# EAGLE design AstableMultivibrator-NPN-alt (EAGLE 7.2.0)
Forced quenching improves three-transistor FM tuner Lyle Williams -February 29, 2016 http://edn.com/design/diy/4441531/Forced-quenching-improves-three-transistor-FM-tuner
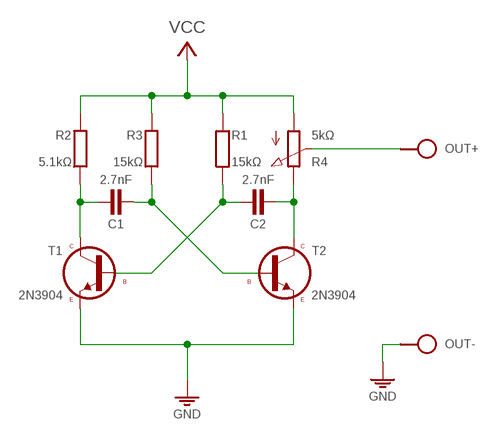
[diagram p0: schematic, sheet 1]

## Parts
C1  2.7nF  C-H075-020X044  [C0750-020X044]
C2  2.7nF  C-H075-020X044  [C0750-020X044]
J1  VCC_GNDPWR-L  [PWR-L]
OUT  SPAD+-+-  [SPAD+-]
R1  15kΩ  R0204/10-V  [0204/10-V]
R2  5.1kΩ  R0204/10-V  [0204/10-V]
R3  15kΩ  R0204/10-V  [0204/10-V]
R4  5kΩ  POT-V  [POT-V]
T1  2N3904  [TO92]
T2  2N3904  [TO92]

## Nets
GND: J1.1 OUT.1 T1.1(E) T2.1(E)
N$1: C2.2 R4.E T2.3(C)
N$2: C1.1 R2.2 T1.3(C)
N$3: C2.1 R1.2 T1.2(B)
N$4: C1.2 R3.2 T2.2(B)
N$6: OUT.2 R4.S
VCC: J1.2 R1.1 R2.1 R3.1 R4.A

## Library data of the parts
C1 C2 = c:C-H
J1 = pad:VCC_GND
OUT = pad:SPAD+-
R1-R3 = r:R: RESISTOR, European symbol
R4 = r:POT
T1 T2 = t:2N3904

## Net classes
0 default: width 0.61 mm

## Board
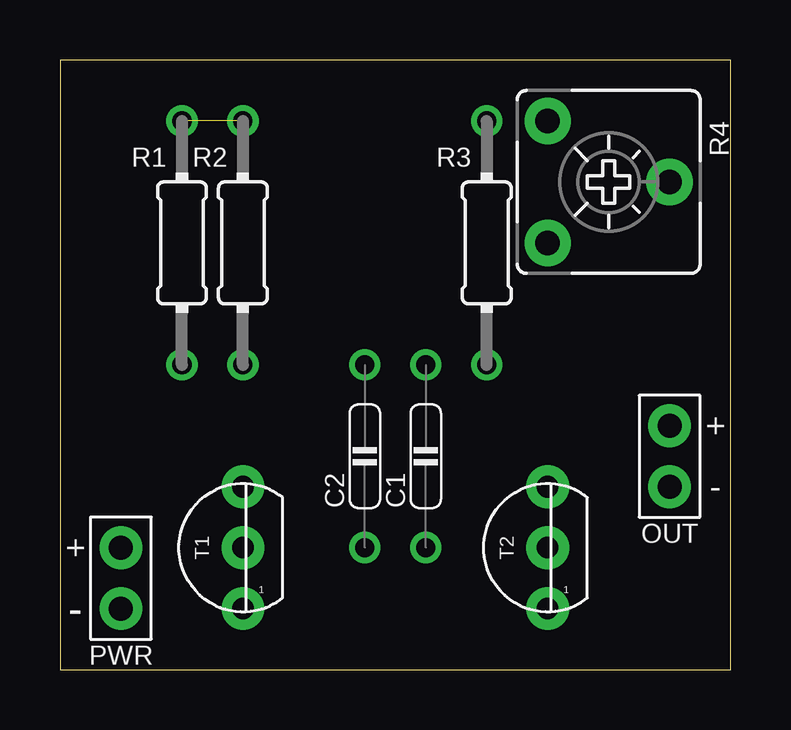
[diagram p1: board, top side]
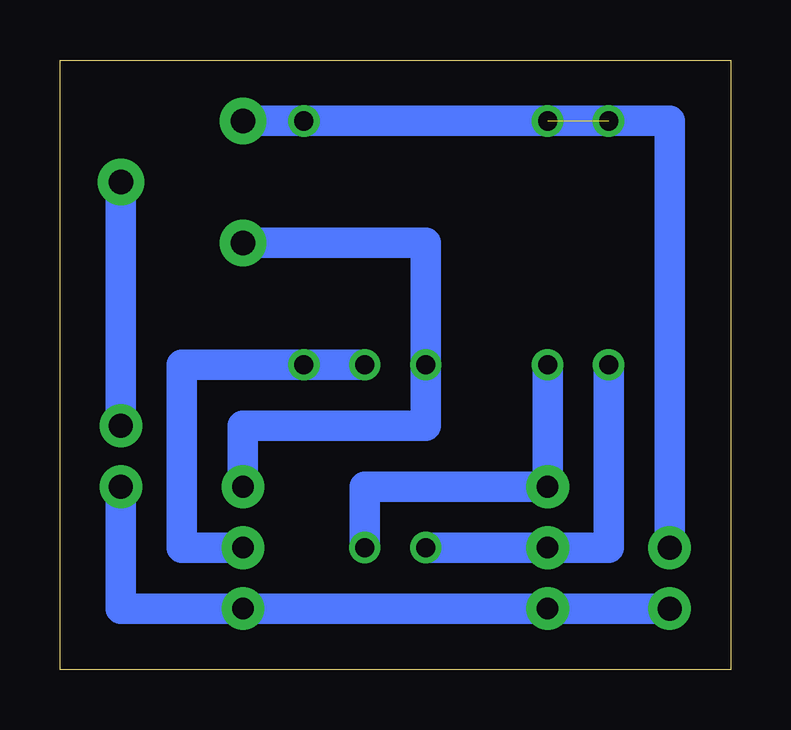
[diagram p2: board, bottom side, seen from below]

Size 27.94 x 25.4 mm. Coordinates in mm from the lower left corner, seen from the top.
Outline: 0,0 27.94,0 27.94,25.4 0,25.4 0,0
Copper layers (1*16): Top 0.035mm / dielectric 1.5mm / Bottom 0.035mm
Design rules "default": minimum track width 10mil, minimum drill 24mil, track to track 8mil, track to pad 8mil, pad to pad 8mil, via to via 8mil, smd to smd 8mil, copper to edge 40mil, drill to drill 8mil, minimum pad ring 10mil, minimum via ring 8mil, stop-mask expansion 4mil, vias tented up to drill 0mil, thermal gap 10mil

### Footprints (pad centres in the part's own frame; a part is rotated, then mirrored left to right if it is on the bottom)
C0750-020X044 = drill 0.8: 1 -3.81,0; 2 3.81,0
PWR-L = drill 1 pad 1.778: 1 0,-1.27; 2 0,1.27
SPAD+- = drill 1 pad 1.778: 1 0,-1.27; 2 0,1.27
0204/10-V = drill 0.8: 1 0,5.08; 2 0,-5.08
POT-V = drill 1.016 pad 1.93: A -2.54,-2.54; E 2.54,-2.54; S 0,2.54
TO92 = drill 0.9 pad 1.778: 1 0,2.54; 2 0,0; 3 0,-2.54

### Placement (x,y rotation side)
C1  15.24,8.89 90 top
C2  12.7,8.89 90 top
J1  2.54,3.81 0 top
OUT  25.4,8.89 0 top
R1  5.08,17.78 0 top
R2  7.62,17.78 0 top
R3  17.78,17.78 0 top
R4  22.86,20.32 270 top
T1  7.62,5.08 180 top
T2  20.32,5.08 180 top

### Tracks (layer width: path | path; a pad name or v marks a point on that pad's centre or on a via)
GND
  Bottom 1.27: OUT.1 25.4,2.54 T2.1 T1.1 J1.1
N$1
  Bottom 1.27: R4.E 12.7,17.78 C2.2 12.7,10.16 20.32,10.16 T2.3
N$2
  Bottom 1.27: R2.2 T1.3 15.24,7.62 C1.1
N$3
  Bottom 1.27: R1.2 5.08,5.08 T1.2 C2.1
N$4
  Bottom 1.27: T2.2 22.86,5.08 22.86,12.7 R3.2 C1.2
N$6
  Bottom 1.27: R4.S OUT.2
VCC  (1 unrouted)
  Bottom 1.27: J1.2 2.54,22.86 R2.1 R3.1 R4.A